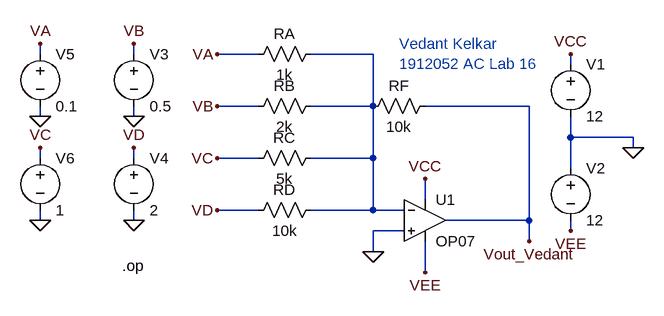
[diagram p0: schematic AC_Lab16a.asc]
AC_Lab16a.asc, the LTspice schematic file:
Version 4
SHEET 1 880 680
WIRE -400 -80 -400 -96
WIRE -256 -80 -256 -96
WIRE -64 -80 -128 -80
WIRE 112 -80 16 -80
WIRE 416 -64 416 -80
WIRE -64 0 -128 0
WIRE 112 0 112 -80
WIRE 112 0 16 0
WIRE 352 0 192 0
WIRE -400 16 -400 0
WIRE -256 16 -256 0
WIRE 416 48 416 16
WIRE 512 48 416 48
WIRE 512 64 512 48
WIRE -400 80 -400 64
WIRE -256 80 -256 64
WIRE -64 80 -128 80
WIRE 112 80 112 0
WIRE 112 80 16 80
WIRE 416 96 416 48
WIRE 192 144 192 112
WIRE -64 160 -128 160
WIRE 112 160 112 80
WIRE 112 160 16 160
WIRE 160 160 112 160
WIRE -400 176 -400 160
WIRE -256 176 -256 160
WIRE 352 176 352 0
WIRE 352 176 224 176
WIRE 160 192 112 192
WIRE 416 192 416 176
WIRE 352 208 352 176
WIRE 112 224 112 192
WIRE 192 256 192 208
FLAG 112 224 0
FLAG -128 -80 VA
FLAG -128 0 VB
FLAG -128 80 VC
FLAG -128 160 VD
FLAG -256 -96 VB
FLAG -400 -96 VA
FLAG -400 64 VC
FLAG -256 64 VD
FLAG 192 112 VCC
FLAG 192 256 VEE
FLAG 416 192 VEE
FLAG 416 -80 VCC
FLAG -400 16 0
FLAG -256 16 0
FLAG -256 176 0
FLAG -400 176 0
FLAG 512 64 0
FLAG 352 208 Vout_Vedant
SYMBOL OpAmps\\OP07 192 112 R0
SYMATTR InstName U1
SYMBOL res 32 144 R90
WINDOW 0 0 56 VBottom 2
WINDOW 3 32 56 VTop 2
SYMATTR InstName RD
SYMATTR Value 10k
SYMBOL res 32 64 R90
WINDOW 0 0 56 VBottom 2
WINDOW 3 32 56 VTop 2
SYMATTR InstName RC
SYMATTR Value 5k
SYMBOL res 32 -16 R90
WINDOW 0 0 56 VBottom 2
WINDOW 3 32 56 VTop 2
SYMATTR InstName RB
SYMATTR Value 2k
SYMBOL res 32 -96 R90
WINDOW 0 0 56 VBottom 2
WINDOW 3 32 56 VTop 2
SYMATTR InstName RA
SYMATTR Value 1k
SYMBOL res 208 -16 R90
WINDOW 0 0 56 VBottom 2
WINDOW 3 32 56 VTop 2
SYMATTR InstName RF
SYMATTR Value 10k
SYMBOL voltage 416 -80 R0
SYMATTR InstName V1
SYMATTR Value 12
SYMBOL voltage 416 80 R0
SYMATTR InstName V2
SYMATTR Value 12
SYMBOL voltage -256 -96 R0
SYMATTR InstName V3
SYMATTR Value 0.5
SYMBOL voltage -256 64 R0
SYMATTR InstName V4
SYMATTR Value 2
SYMBOL voltage -400 -96 R0
SYMATTR InstName V5
SYMATTR Value 0.1
SYMBOL voltage -400 64 R0
SYMATTR InstName V6
SYMATTR Value 1
TEXT 152 -96 Left 2 ;Vedant Kelkar \n1912052 AC Lab 16
TEXT -274 246 Left 2 !.op

The netlist it stands for:
* AC_Lab16a.asc
XU1 0 N001 VCC VEE Vout_Vedant LT1001  ; OP07, pins In+ In- V+ V- OUT
RD N001 VD 10k
RC N001 VC 5k
RB N001 VB 2k
RA N001 VA 1k
RF Vout_Vedant N001 10k
V1 VCC 0 12
V2 0 VEE 12
V3 VB 0 0.5
V4 VD 0 2
V5 VA 0 0.1
V6 VC 0 1
* Vedant Kelkar
* 1912052 AC Lab 16
.op
.lib LTC.lib
.backanno
.end